# EAGLE schematic connector_raspberrypi (EAGLE 9.2.2)
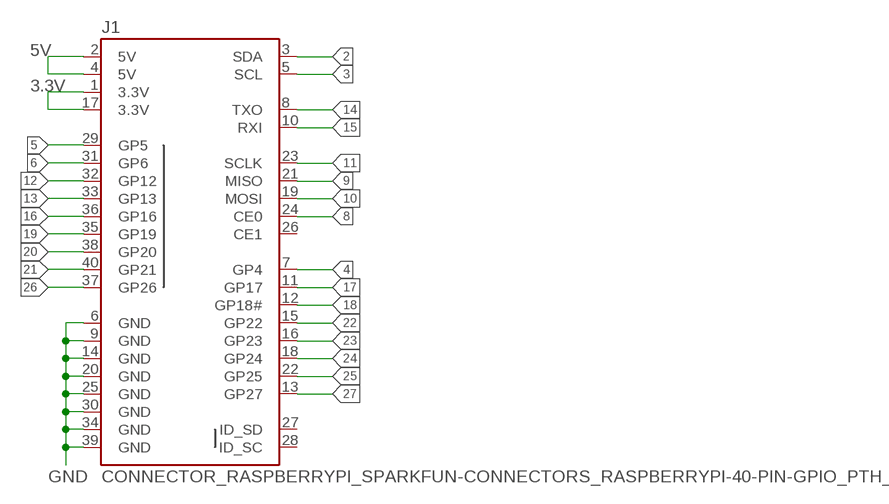
[diagram p0: schematic, sheet 1]

## Parts
J1  CONNECTOR_RASPBERRYPI_SPARKFUN-CONNECTORS_RASPBERRYPI-40-PIN-GPIO_PTH_NO_SHROUD  [CONNECTOR_RASPBERRYPI_SPARKFUN-CONNECTORS_2X20]

## Nets
2: J1.3(SDA)
3: J1.5(SCL)
3.3V: J1.1(3.3V) J1.17(3.3V)
4: J1.7(GP4)
5: J1.29(GP5)
5V: J1.2(5V) J1.4(5V)
6: J1.31(GP6)
8: J1.24(CE0)
9: J1.21(MISO)
10: J1.19(MOSI)
11: J1.23(SCLK)
12: J1.32(GP12)
13: J1.33(GP13)
14: J1.8(TXO)
15: J1.10(RXI)
16: J1.36(GP16)
17: J1.11(GP17)
18: J1.12(GP18#)
19: J1.35(GP19)
20: J1.38(GP20)
21: J1.40(GP21)
22: J1.15(GP22)
23: J1.16(GP23)
24: J1.18(GP24)
25: J1.22(GP25)
26: J1.37(GP26)
27: J1.13(GP27)
GND: J1.6(GND) J1.9(GND) J1.14(GND) J1.20(GND) J1.25(GND) J1.30(GND) J1.34(GND) J1.39(GND)
Unconnected: J1.26(CE1) J1.27(ID_SD) J1.28(ID_SC)

## Library data of the parts
J1 = connector_raspberrypi:CONNECTOR_RASPBERRYPI_SPARKFUN-CONNECTORS_RASPBERRYPI-40-PIN-GPIO: Raspberry Pi GPIO Header 2x20 pin connector, as found on B, B+, A+ models. Both shrouded PTH and SMT versions available. SparkFun Products: GPIO Shrouded Header <https://www.sparkfun.com/products/13054>- PTH SparkFun Pi Wedge (Preassembled) <https://www.sparkfun.com/products/13717>